# Altium schematic sheet hydrophone_preamp_and_filter.SchDoc
size A; SheetNumber: 1; SheetTotal: 1
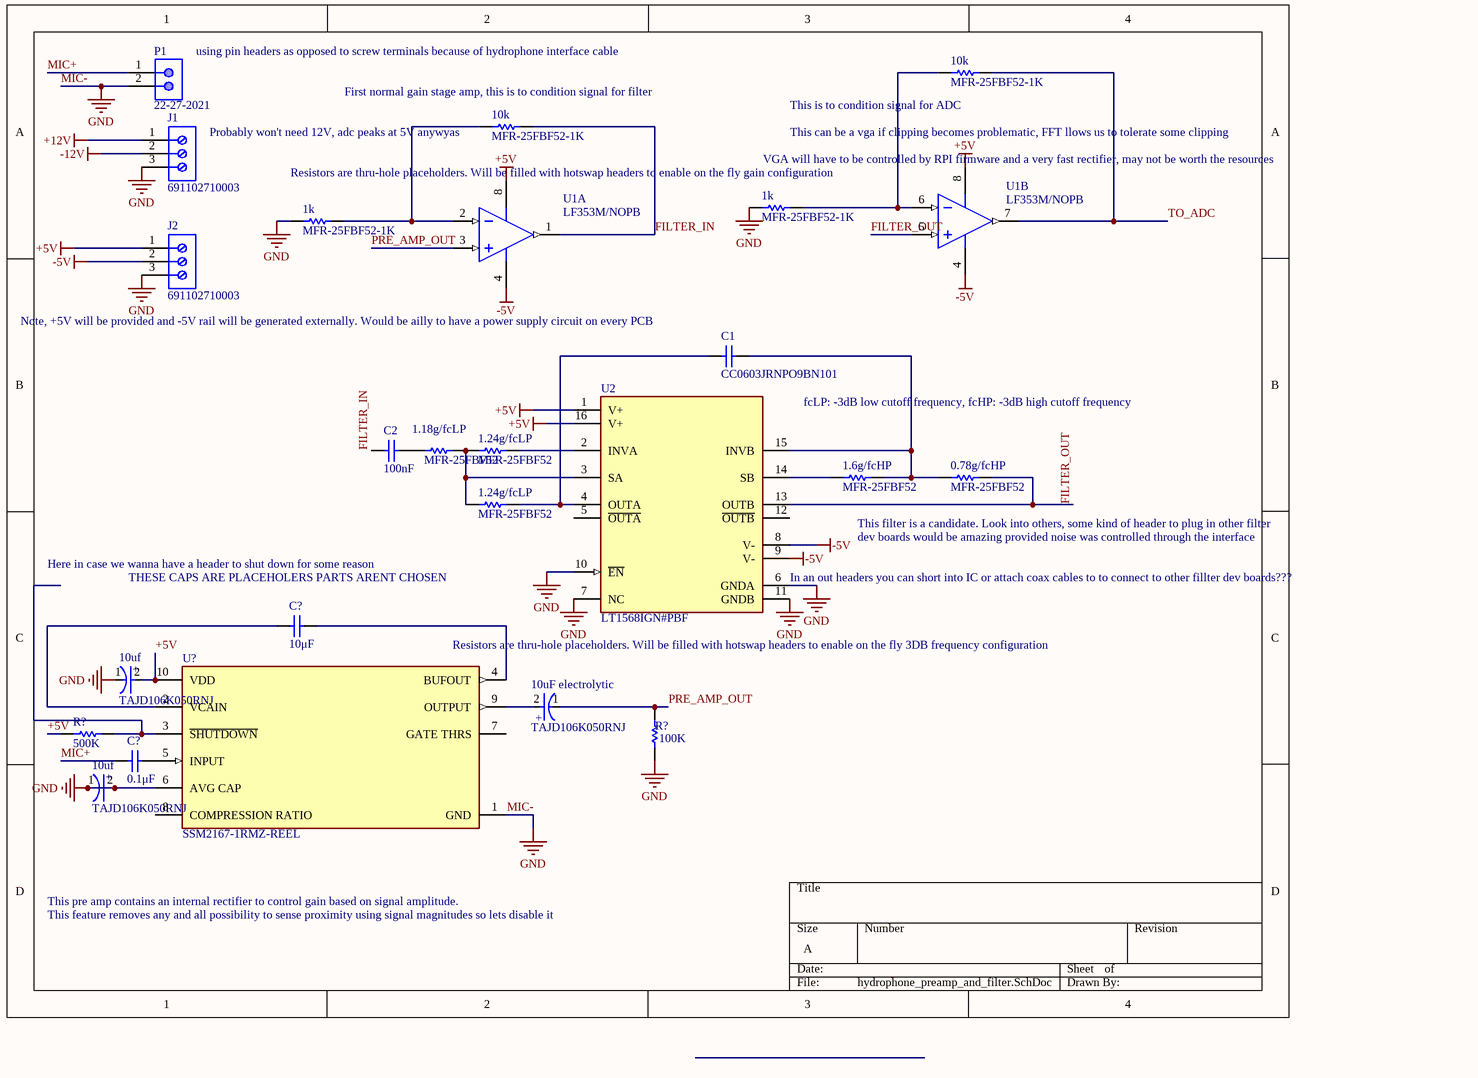
[diagram p0: hydrophone_preamp_and_filter.SchDoc]

## Parts
(Parts that share a designator on the sheet are numbered #1, #2 ... from top to bottom, then left to right.)
0.78g/fcHP  MFR-25FBF52  [RESA60-630X240]
1.6g/fcHP  MFR-25FBF52  [RESA60-630X240]
1.18g/fcLP  MFR-25FBF52  [RESA60-630X240]
1.24g/fcLP#1  MFR-25FBF52  [RESA60-630X240]
1.24g/fcLP#2  MFR-25FBF52  [RESA60-630X240]
1k#1  MFR-25FBF52-1K  [RESA60-630X240]
1k#2  MFR-25FBF52-1K  [RESA60-630X240]
10k#1  MFR-25FBF52-1K  [RESA60-630X240]
10k#2  MFR-25FBF52-1K  [RESA60-630X240]
10uf#1  TAJD106K050RNJ  [FP-TAJD-MFG]
10uf#2  TAJD106K050RNJ  [FP-TAJD-MFG]
10uF_electrolytic  TAJD106K050RNJ  [FP-TAJD-MFG]
C1  CC0603JRNPO9BN101  [CAPC1608X90X40ML10T20]
C2  100nF  [CAPC1812(4532)100_M]
C?#1  value 10μF  (hidden comment: Capacitor)
C?#2  value 0.1μF  (hidden comment: Capacitor)
J1  691102710003  [691102710003]
J2  691102710003  [691102710003]
P1  22-27-2021  [MOLX-22-27-2021_V]
R?#1  value 500K  (hidden comment: Resistor)
R?#2  value 100K  (hidden comment: Resistor)
U1  LF353M/NOPB  [D0008A_M]  (parts A,B of 2)
U2  LT1568IGN#PBF  [FP-GN-16-05-08-1641-IPC_A]
U?  SSM2167-1RMZ-REEL  [FP-RM-10-IPC_B]

## Nets
+5V: 10uf#1.2(A) J2.1 R?#1.1 U1.8(V+) U2.1(V+) U2.16(V+) U?.10(VDD)
+12V: J1.1
-5V: J2.2 U1.4(V-) U2.8(V-) U2.9(V-)
-12V: J1.2
MIC-: 1k#1.1 1k#2.1 10uf#1.1(C) 10uf#2.1(C) 10uf#2.2(A) J1.3 J2.3 P1.2 R?#2.1 U2.6(GNDA) U2.7(NC) U2.10(~{EN}) U2.11(GNDB) U?.1(GND) U?.6(AVG_CAP)  [also labelled GND]
FILTER_IN: 10k#2.2 C2.1 U1.1(OUTA)
FILTER_OUT: 0.78g/fcHP.2 U1.5(INB+) U2.13(OUTB)
MIC+: C?#2.1 P1.1
PRE_AMP_OUT: 10uF_electrolytic.1(C) R?#2.2 U1.3(INA+)
TO_ADC: 10k#1.2 U1.7(OUTB)
Net0.78g/fcHP_1: 0.78g/fcHP.1 1.6g/fcHP.2 C1.2 U2.15(INVB)
Net1.6g/fcHP_1: 1.6g/fcHP.1 U2.14(SB)
Net1.18g/fcLP_1: 1.18g/fcLP.1 C2.2
Net1.18g/fcLP_2: 1.18g/fcLP.2 1.24g/fcLP#1.1 1.24g/fcLP#2.1 U2.3(SA)
Net1.24g/fcLP#1_2: 1.24g/fcLP#1.2 U2.2(INVA)
Net1.24g/fcLP#2_2: 1.24g/fcLP#2.2 C1.1 U2.4(OUTA)
Net1k#1_2: 1k#1.2 10k#1.1 U1.6(INB-)
Net1k#2_2: 1k#2.2 10k#2.1 U1.2(INA-)
Net10uF_electrolytic_2: 10uF_electrolytic.2(A) U?.9(OUTPUT)
NetC?#1_1: C?#1.1 U?.2(VCAIN)
NetC?#1_2: C?#1.2 U?.4(BUFOUT)
NetC?#2_2: C?#2.2 U?.5(INPUT)
NetR?#1_2: R?#1.2 U?.3(~{SHUTDOWN})

Not connected (* = marked no-connect by the designer): U2 5(~{OUTA}) 12(~{OUTB}); U? 7(GATE_THRS) 8(COMPRESSION_RATIO)

## Notes on the sheet
- using pin headers as opposed to screw terminals because of hydrophone interface cable
- (near 10k#2) First normal gain stage amp, this is to condition signal for filter
- (near 10k#2) Probably won't need 12V, adc peaks at 5V anywyas
- VGA will have to be controlled by RPI firmware and a very fast rectifier, may not be worth the resources
- (near 10k#1) This is to condition signal for ADC
- This can be a vga if clipping becomes problematic, FFT llows us to tolerate some clipping
- (near U1) Resistors are thru-hole placeholders. Will be filled with hotswap headers to enable on the fly gain configuration
- Note, +5V will be provided and -5V rail will be generated externally. Would be ailly to have a power supply circuit on every PCB
- (near U2) fcLP: -3dB low cutoff frequency, fcHP: -3dB high cutoff frequency
- Here in case we wanna have a header to shut down for some reason
- This filter is a candidate. Look into others, some kind of header to plug in other filter
- dev boards would be amazing provided noise was controlled through the interface
- (near C?#1) THESE CAPS ARE PLACEHOLERS PARTS ARENT CHOSEN
- (near U2) In an out headers you can short into IC or attach coax cables to to connect to other fillter dev boards???
- Resistors are thru-hole placeholders. Will be filled with hotswap headers to enable on the fly 3DB frequency configuration
- This pre amp contains an internal rectifier to control gain based on signal amplitude.
- This feature removes any and all possibility to sense proximity using signal magnitudes so lets disable it
- (in symbol CMP-2000-05063-2) +

## Library data of the parts
0.78g/fcHP 1.6g/fcHP 1.18g/fcLP 1.24g/fcLP#1 1.24g/fcLP#2 1k#1 1k#2 10k#1 10k#2 = CMP-1659-00075-1: Axial Resistor, 1 KOhm, +/- 1%, 250 mW, -55 to 155 degC, 2-Pin THD, RoHS, Bulk; Voltage Rating: 250 V; Resistance: 10 kohm; Power Rating: 250 mW; ComponentLink2Description: Datasheet; RoHSCompliant: true; PackageReference: MFR-25; Case\Package: Axial; Max Operating Temperature: 155 degC; DatasheetVersion: Apr-13; Tolerance: 1%; ComponentLink1URL: http://www.yageo.com/; Length: 0.248 inch; ComponentLink2URL: http://www.yageo.com/documents/recent/Yageo%20LR_MFR_2013.pdf; Packaging: Bulk; Package Quantity: 200; PackageDescription: 2-Pin Axial Lead, Dia 2.4 mm, Body Length 6.3 mm; Min Operating Temperature: -55 degC; ComponentLink1Description: Manufacturer URL
10uf#1 10uf#2 10uF_electrolytic = CMP-2000-05063-2: 10uF 50V  ±10% 800mΩ 2917  SMD Tantalum Capacitor; Dissipation Factor: 6%; ESR (Equivalent Series Resistance): 800mR; Polarity: Polar; Leakage Current: 5uA; Voltage: 50V; Construction: Flat; REACH SVHC: No SVHC; Case Code (Metric): 7343; Capacitance: 10uF; Package Quantity: 1; Width: 0.169inch; Length: 7.3mm; Radiation Hardening: No; Dielectric Material: Tantalum; Lead Free: Lead Free; Features: General Purpose; Height - Seated (Max): 0.122inch; Voltage Rating: 50V; Series: TAJ; Number of Pins: 2; Max Operating Temperature: 125°C; Min Operating Temperature: -55°C; Case/Package: 2917; Case Code (Imperial): 2917; Packaging: Tape and Reel; RoHS Compliant: Yes; Tolerance: 10%; Termination: SMD/SMT; Depth: 4.3mm; Mount: Surface Mount; Height: 2.9mm; Voltage Rating (DC): 50V
C1 = CMP-2100-03594-1: Chip Capacitor, 100 pF, +/- 5%, 50 V, -55 to 125 degC, 0603 (1608 Metric), RoHS, Tape and Reel; Manufacturer: Yageo; Capacitance: 100pF; Voltage Rating (DC): 50V; Dielectric: C0G; Temperature Coefficient: 30ppm/degC; Insulation Resistance: 100GR; Datasheet Version: Rev. 14, 07/2016; Manufacturer URL: http://www.yageo.com/; Packaging: TapeandReel; Mount: SurfaceMount; RoHSCompliant: True; Package Reference: 0603; Tolerance: 5%; Max Operating Temperature: 125degC; Case Code (Imperial): 0603; Number of Pins: 2; Width: 0.8mm; Case Code (Metric): 1608; Voltage: 50V; REACH SVHC: Unknown; Package Description: 2-Pin Surface Mount Device, Body 1.6 x 0.8 mm; Composition: Ceramic; Lead Free: LeadFree; Min Operating Temperature: -55degC; Radiation Hardening: No; Depth: 0.8mm; Thickness: 0.035inch; Datasheet URL: http://www.yageo.com/documents/recent/UPY-GP_NP0_16V-to-50V_14.pdf; Termination: SMD/SMT; Package Quantity: 1; Length: 1.6mm; Voltage Rating: 50V; Height: 0.8mm; Case/Package: 0603
C2 = CMP-1040-01293-1: CAP 100nF 50V ±20% 1812 (4532 Metric) Thickness 1mm SMD; Case-Metric: 4532; Tolerance: Â±20%; Case-EIA: 1812; Rated Voltage: 50 V; Value: 100nF; Max Thickness: 1 mm; Technology: SMT
C?#1 C?#2 = Capacitor: SimulationGenericComponent: True
J1 J2 = CMP-1502-03259-2: NexarPartId: 8917707; Current: 15A; Stripping Length: -6mm; Wire/Cable Gauge: 22AWG; Wire Gauge (Min): 14AWG; Pitch: 5.0038mm; Number of Positions Per Level: 3; Plating: Steel; Voltage Rating: 300V; Number of Levels: 1; RoHS: Compliant; Mount: Through Hole; Color: Blue; Length: 7.5mm; Packaging: Box; Min Operating Temperature: -40°C; Housing Material: Nylon; REACH SVHC: Unknown; Current Rating: 15A; Contact Material: Brass; Width: 16.2mm; Height: 13.4mm; Lead Pitch: 5mm; Number of Contacts: 3; Number of Pins: 3; Contact Plating: Tin; Voltage: 300V; Termination: Screw; Max Operating Temperature: 105°C; Wire Gauge (Max): 22AWG
P1 = CMP-2000-05537-1: Male Header, Pitch 2.54 mm, 1 x 2 Position, Height 11.7 mm, Tail Length 3.56 mm, 0 to 75 degC, RoHS, Bulk; Manufacturer: Molex; PartNumber: 0022272021; Current rating: 4A; Package Version: Rev. BC, 02/2012; Voltage rating: 250V; No. of Positions: 2; Pitch: 2.54mm; No. of Rows: 1; Orientation: Vertical; Operating temperature: 0°Cto+75°C; Manufacturer URL: http://www.molex.com/; Mounting Technology: ThroughHole; Housing material: Nylon(UL94V-0); Package Description: 2-Leads Header, Body 5.08 x 5.8 mm, Pitch 2.54 mm; Voltage - Max: 250V; Datasheet URL: http://www.molex.com/pdm_docs/sd/022272021_sd.pdf; Package Reference: 22-27-2021; Contact material: Tinplatedbrass; Current - Max: 4A; Datasheet Version: Rev. F, 06/2009
R?#1 R?#2 = Resistor: TC1: 0; SimulationGenericComponent: True; TC2: 0
U1 = CMP-0055-00856-3: Wide Bandwidth Dual JFET Input Operational Amplifier, 8-pin Narrow SOIC, Pb-Free; Manufacturer: Texas Instruments; PackageTopMarking: NSZXTT*LF353*M; CompType: Amplifiers; PowerWise: N; ComponentLink1URL: http://www.ti.com/general/docs/lit/getliterature.tsp?genericPartNumber=LF353-N&fileType=pdf; Code_IPC: SOIC127P600-8; PinCount: 8; PackageDescription: SOIC Narrow, 4.9 x 3.9 x 1.45mm, 8 Lead, 1.27mm Pitch; RoHS: Y; Code_JEDEC: MS-012-AA; ComponentLink1Description: Datasheet URL; Package Reference: D0008A
U2 = CMP-09108-000005-1: IC FILTER 200KHZ BANDPASS 16SSOP; Dual Supply Voltage: 3V; Max Dual Supply Voltage: 5V; Nominal Supply Current: 26mA; Max Supply Voltage: 11V; Min Supply Voltage: 2.7V; Number of Circuits: 2; Min Dual Supply Voltage: 1.35V; Mount: Surface Mount; Operating Supply Voltage: 3V; Min Operating Temperature: -40°C; Number of Pins: 16; Radiation Hardening: No; Max Operating Temperature: 85°C; Package Quantity: 100; Type: Active; Supply Current: 26mA; Lead Free: Lead Free; Case/Package: SSOP; RoHS Compliant: Yes; Packaging: Rail/Tube; Series: -
U? = CMP-09115-000013-1: IC AMP CLASS AB MONO 10MSOP; Quiescent Current: 2.3mA; Gain Bandwidth Product: 1MHz; Min Supply Voltage: 2.5V; Nominal Supply Current: 5mA; Power Supply Rejection Ratio (PSRR): 45dB; Number of Channels: 1; Load Impedance: 100kR; Max Supply Voltage: 5.5V; Radiation Hardening: No; Number of Pins: 10; REACH SVHC: No SVHC; Series: -; Operating Supply Current: 5mA; Supply Current: 5mA; Mount: Surface Mount; Bandwidth: 1MHz; Package Quantity: 1; Lead Free: Contains Lead; Max Operating Temperature: 85°C; Max Supply Current: 5mA; RoHS Compliant: Yes; Min Operating Temperature: -40°C; Case/Package: MSOP; Contact Plating: Tin; Packaging: Tape and Reel; Unity Gain Bandwidth Product: 1MHz